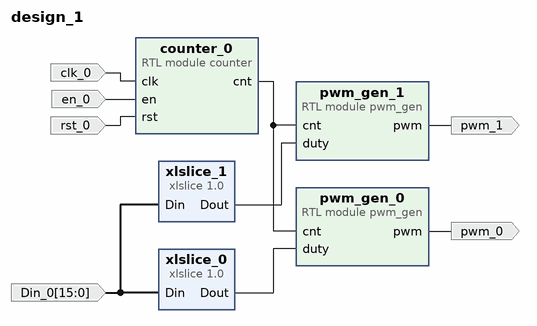
[diagram p0: block diagram of the top level]
# Vivado block design design_1, xc7z020clg400-1, Vivado 2023.2
create_bd_design design_1

create_bd_port -dir O pwm_0
create_bd_port -dir I -type clk clk_0
create_bd_port -dir I en_0
create_bd_port -dir I -type rst rst_0
create_bd_port -dir O pwm_1
create_bd_port -dir I -from 15 -to 0 Din_0

create_bd_cell -type module -reference counter counter_0
set_property -dict {CONFIG.n_bits 8} [get_bd_cells counter_0]
create_bd_cell -type module -reference pwm_gen pwm_gen_0
set_property -dict {CONFIG.n_bits 8} [get_bd_cells pwm_gen_0]
create_bd_cell -type module -reference pwm_gen pwm_gen_1
set_property -dict {CONFIG.n_bits 8} [get_bd_cells pwm_gen_1]
create_bd_cell -type ip -vlnv xilinx.com:ip:xlslice:1.0 xlslice_0
set_property -dict {CONFIG.DIN_FROM 15 CONFIG.DIN_TO 8 CONFIG.DIN_WIDTH 16} [get_bd_cells xlslice_0]
create_bd_cell -type ip -vlnv xilinx.com:ip:xlslice:1.0 xlslice_1
set_property -dict {CONFIG.DIN_FROM 7 CONFIG.DIN_WIDTH 16} [get_bd_cells xlslice_1]

# ---- connections ----

connect_bd_net -net Din_0_1 [get_bd_ports Din_0] [get_bd_pins xlslice_0/Din] [get_bd_pins xlslice_1/Din]
connect_bd_net -net clk_0_1 [get_bd_ports clk_0] [get_bd_pins counter_0/clk]
connect_bd_net [get_bd_pins counter_0/cnt] [get_bd_pins pwm_gen_0/cnt] [get_bd_pins pwm_gen_1/cnt]
connect_bd_net -net en_0_1 [get_bd_ports en_0] [get_bd_pins counter_0/en]
connect_bd_net [get_bd_pins pwm_gen_0/pwm] [get_bd_ports pwm_0]
connect_bd_net [get_bd_pins pwm_gen_1/pwm] [get_bd_ports pwm_1]
connect_bd_net -net rst_0_1 [get_bd_ports rst_0] [get_bd_pins counter_0/rst]
connect_bd_net [get_bd_pins xlslice_0/Dout] [get_bd_pins pwm_gen_0/duty]
connect_bd_net [get_bd_pins xlslice_1/Dout] [get_bd_pins pwm_gen_1/duty]

validate_bd_design
save_bd_design
